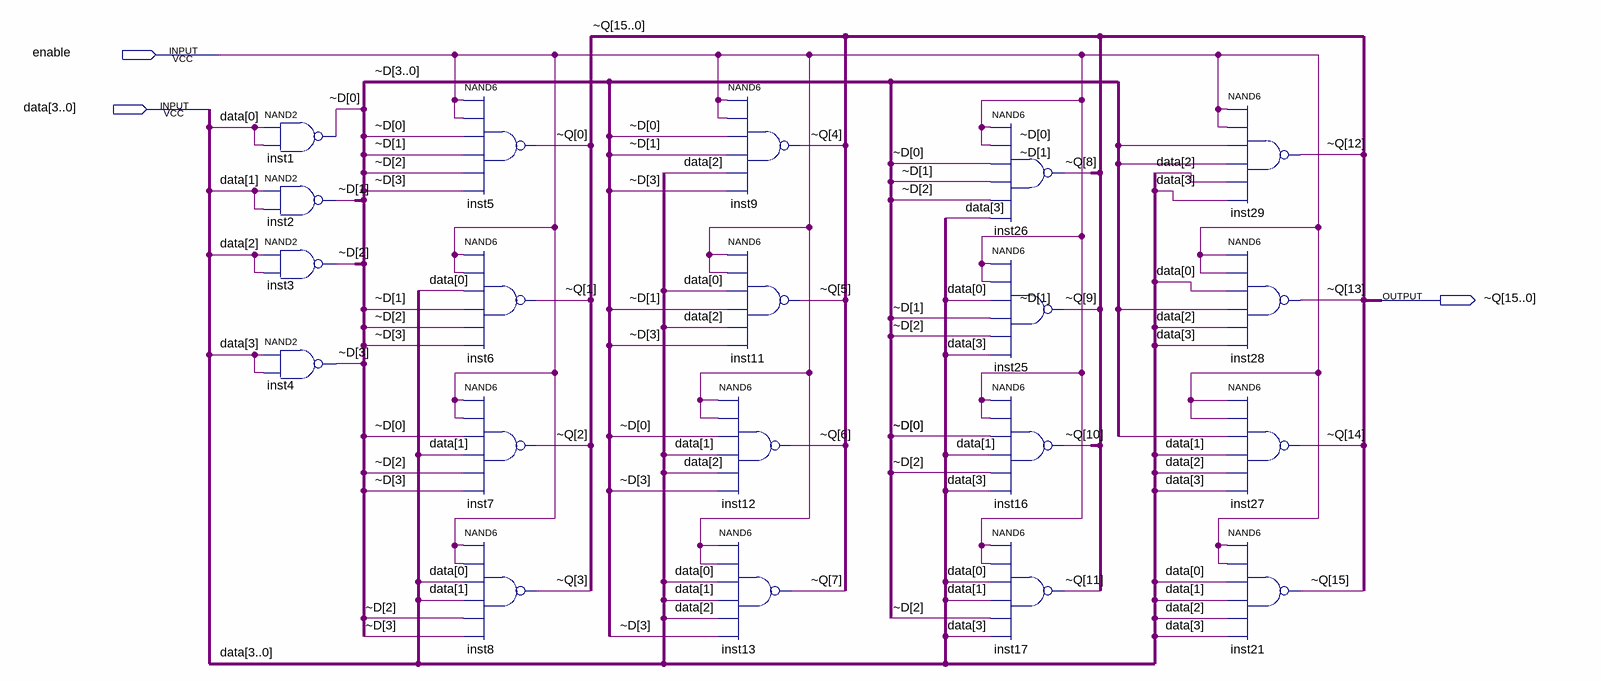
[diagram p0: schematic sheet]
// Quartus schematic p1.bdf as structural Verilog: 20 symbols, 3 pins
module p1 (
  input  enable,
  input  [3:0] data,
  output [15:0] \~Q 
);

  wire [3:0] \~D ;

  nand inst1 (\~D [0], data[0], data[0]);
  nand inst2 (\~D [1], data[1], data[1]);
  nand inst3 (\~D [2], data[2], data[2]);
  nand inst4 (\~D [3], data[3], data[3]);
  nand inst5 (\~Q [0], enable, enable, \~D [0], \~D [1], \~D [2], \~D [3]);
  nand inst6 (\~Q [1], enable, enable, data[0], \~D [1], \~D [2], \~D [3]);
  nand inst7 (\~Q [2], enable, enable, \~D [0], data[1], \~D [2], \~D [3]);
  nand inst8 (\~Q [3], enable, enable, data[0], data[1], \~D [2], \~D [3]);
  nand inst9 (\~Q [4], enable, enable, \~D [0], \~D [1], data[2], \~D [3]);
  nand inst11 (\~Q [5], enable, enable, data[0], \~D [1], data[2], \~D [3]);
  nand inst12 (\~Q [6], enable, enable, \~D [0], data[1], data[2], \~D [3]);
  nand inst13 (\~Q [7], enable, enable, data[0], data[1], data[2], \~D [3]);
  nand inst26 (\~Q [8], enable, enable, \~D [0], \~D [1], \~D [2], data[3]);
  nand inst25 (\~Q [9], enable, enable, data[0], \~D [1], \~D [2], data[3]);
  nand inst16 (\~Q [10], enable, enable, \~D [0], data[1], \~D [2], data[3]);
  nand inst17 (\~Q [11], enable, enable, data[0], data[1], \~D [2], data[3]);
  nand inst29 (\~Q [12], enable, enable, \~D [0], \~D [1], data[2], data[3]);
  nand inst28 (\~Q [13], enable, enable, data[0], \~D [1], data[2], data[3]);
  nand inst27 (\~Q [14], enable, enable, \~D [0], data[1], data[2], data[3]);
  nand inst21 (\~Q [15], enable, enable, data[0], data[1], data[2], data[3]);
endmodule
